# EAGLE design AVR_ISP_programmer (EAGLE 5.09)
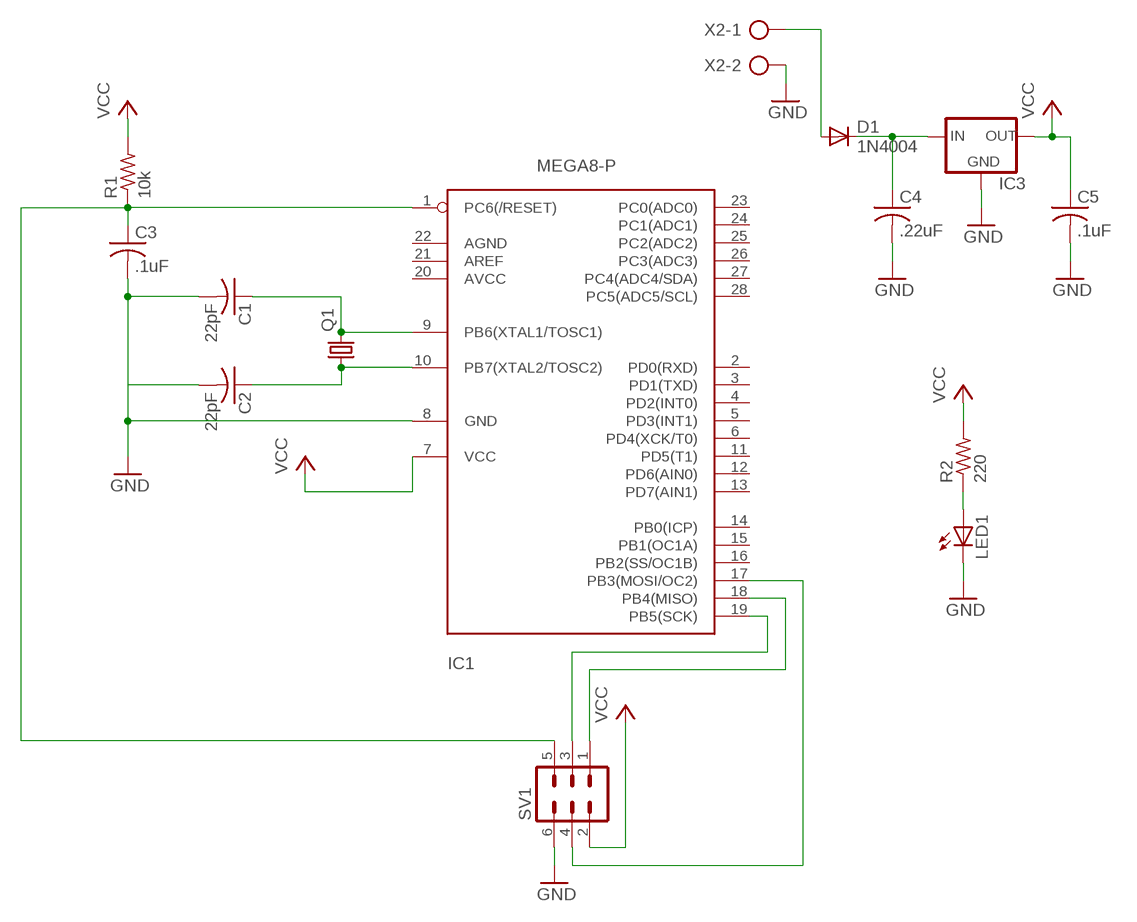
[diagram p0: schematic, sheet 1]

## Parts
C1  22pF  C-US025-024X044  [C025-024X044]
C2  22pF  C-US025-024X044  [C025-024X044]
C3  .1uF  C-US050-030X075  [C050-030X075]
C4  .22uF  C-US025-024X044  [C025-024X044]
C5  .1uF  C-US025-024X044  [C025-024X044]
D1  1N4004  [DO41-10]
IC1  MEGA8-P  [DIL28-3]
IC3  78XXS  [78XXS]
LED1  LED3MM  [LED3MM]
Q1  CRYSTALHC18U-V  [HC18U-V]
R1  10k  R-US_0207/10  [0207/10]
R2  220  R-US_0207/10  [0207/10]
SV1  MA03-2  [MA03-2]
X2  AK300/2  [AK300/2]

## Nets
GND: C1.2 C2.2 C3.2 C4.2 C5.2 IC1.8(GND) IC3.GND LED1.K(C) SV1.6 X2.2
N$1: LED1.A R2.1
N$2: C1.1 IC1.9(PB6(XTAL1/TOSC1)) Q1.2
N$3: C2.1 IC1.10(PB7(XTAL2/TOSC2)) Q1.1
N$4: C3.1 IC1.1(PC6(/RESET)) R1.1 SV1.5
N$5: C4.1 D1.C IC3.IN
N$6: D1.A X2.1
N$7: IC1.18(PB4(MISO)) SV1.1
N$8: IC1.19(PB5(SCK)) SV1.3
N$9: IC1.17(PB3(MOSI/OC2)) SV1.4
VCC: C5.1 IC1.7(VCC) IC3.OUT R1.2 R2.2 SV1.2
Unconnected: IC1.2(PD0(RXD)) IC1.3(PD1(TXD)) IC1.4(PD2(INT0)) IC1.5(PD3(INT1)) IC1.6(PD4(XCK/T0)) IC1.11(PD5(T1)) IC1.12(PD6(AIN0)) IC1.13(PD7(AIN1)) IC1.14(PB0(ICP)) IC1.15(PB1(OC1A)) IC1.16(PB2(SS/OC1B)) IC1.21(AREF) IC1.23(PC0(ADC0)) IC1.24(PC1(ADC1)) IC1.25(PC2(ADC2)) IC1.26(PC3(ADC3)) IC1.27(PC4(ADC4/SDA)) IC1.28(PC5(ADC5/SCL))

## Power pins joined to a net without a drawn wire
AGND: IC1.22(AGND)
AVCC: IC1.20(AVCC)

## Library data of the parts
C1-C5 = resistor:C-US: CAPACITOR, American symbol
D1 = diode:1N4004: DIODE general purpose rectifier, 1 A
IC1 = atmel:MEGA8-P: MICROCONTROLLER 8 Kbytes FLASH, 1 kbytes SRAM, 512 bytes EEPROM, USART, 4-channel 10 bit ADC, 2-channel 8 bit ADC Pin compatible with Atmega48, ATMega88, ATMega168 Source: avr.lbr
IC3 = v-reg:78XXS: VOLTAGE REGULATOR
LED1 = led:LED: LED OSRAM: - CHIPLED LG R971, LG N971, LY N971, LG Q971, LY Q971, LO R971, LY R971 LH N974, LH R974 LS Q976, LO Q976, LY Q976 LO Q996 - Hyper CHIPLED LW Q18S LB Q993, LB Q99A, LB R99A - SideLED LS A670, LO A670, LY A670, LG A670, LP A670 LB A673, LV A673, LT A673, LW A673 LH A674 LY A675 LS A676, LA A676, LO A676, LY A676, LW A676 LS A679, LY A679, LG A679 - Hyper Micro SIDELED® LS Y876, LA Y876, LO Y876, LY Y876 LT Y87S - SmartLED LW L88C, LW L88S LB L89C, LB L89S, LG L890 LS L89K, LO L89K, LY L89K LS L896, LA L896, LO L896, LY L896 - TOPLED LS T670, LO T670, LY T670, LG T670, LP T670 LSG T670, LSP T670, LSY T670, LOP T670, LYG T670 LG T671, LOG T671, LSG T671 LB T673, LV T673, LT T673, LW T673 LH T674 LS T676, LA T676, LO T676, LY T676, LB T676, LH T676, LSB T676, LW T676 LB T67C, LV T67C, LT T67C, LS T67K, LO T67K, LY T67K, LW E67C LS E67B, LA E67B, LO E67B, LY E67B, LB E67C, LV E67C, LT E67C LW T67C LS T679, LY T679, LG T679 LS T770, LO T770, LY T770, LG T770, LP T770 LB T773, LV T773, LT T773, LW T773 LH T774 LS E675, LA E675, LY E675, LS T675 LS T776, LA T776, LO T776, LY T776, LB T776 LHGB T686 LT T68C, LB T68C - Hyper Mini TOPLED® LB M676 - Mini TOPLED Santana® LG M470 LS M47K, LO M47K, LY M47K Source: http://www.osram.convergy.de LUXEON: - LUMILED® LXK2-PW12-R00, LXK2-PW12-S00, LXK2-PW14-U00, LXK2-PW14-V00 LXK2-PM12-R00, LXK2-PM12-S00, LXK2-PM14-U00 LXK2-PE12-Q00, LXK2-PE12-R00, LXK2-PE12-S00, LXK2-PE14-T00, LXK2-PE14-U00 LXK2-PB12-K00, LXK2-PB12-L00, LXK2-PB12-M00, LXK2-PB14-N00, LXK2-PB14-P00, LXK2-PB14-Q00 LXK2-PR12-L00, LXK2-PR12-M00, LXK2-PR14-Q00, LXK2-PR14-R00 LXK2-PD12-Q00, LXK2-PD12-R00, LXK2-PD12-S00 LXK2-PH12-R00, LXK2-PH12-S00 LXK2-PL12-P00, LXK2-PL12-Q00, LXK2-PL12-R00 Source: www.luxeon.com KINGBRIGHT: KA-3528ASYC Source: www.kingbright.com
Q1 = crystal:CRYSTAL: CRYSTAL
R1 R2 = resistor:R-US_: RESISTOR, American symbol
SV1 = con-lstb:MA03-2: PIN HEADER
X2 = con-ptr500:AK300/2: CONNECTOR

## Board
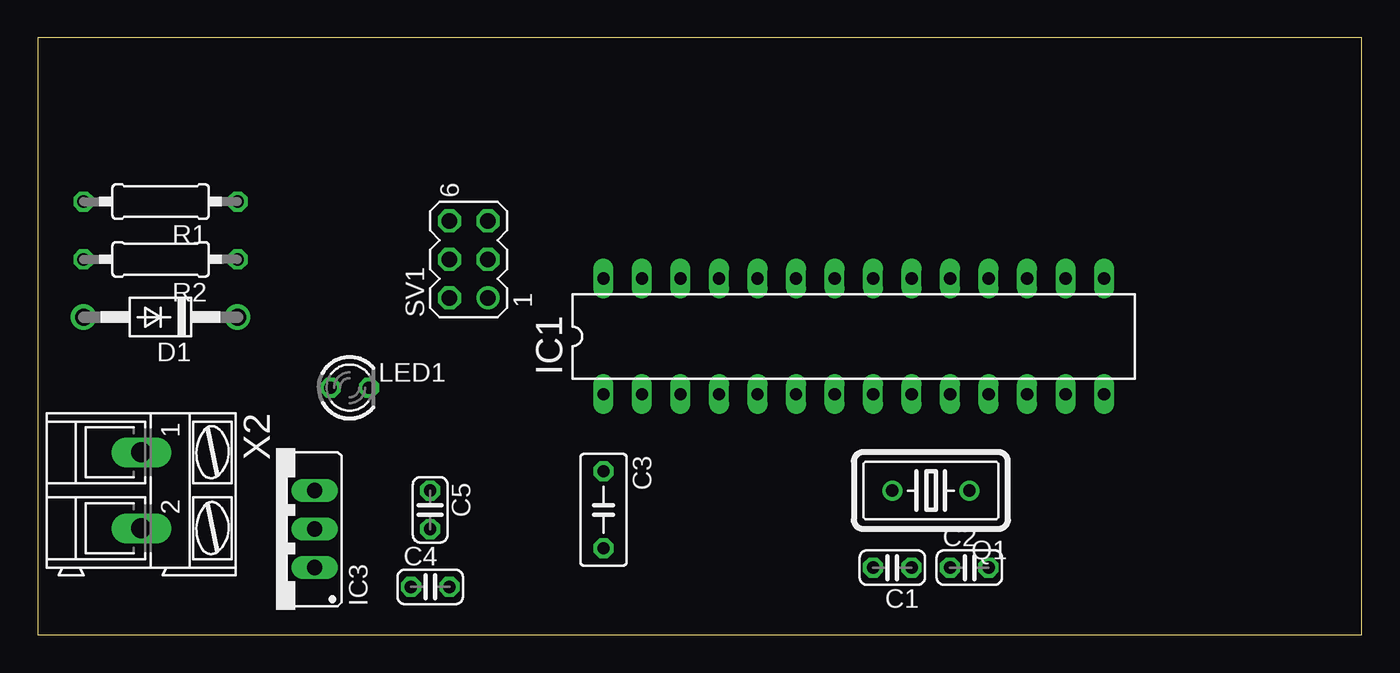
[diagram p1: board, top side]
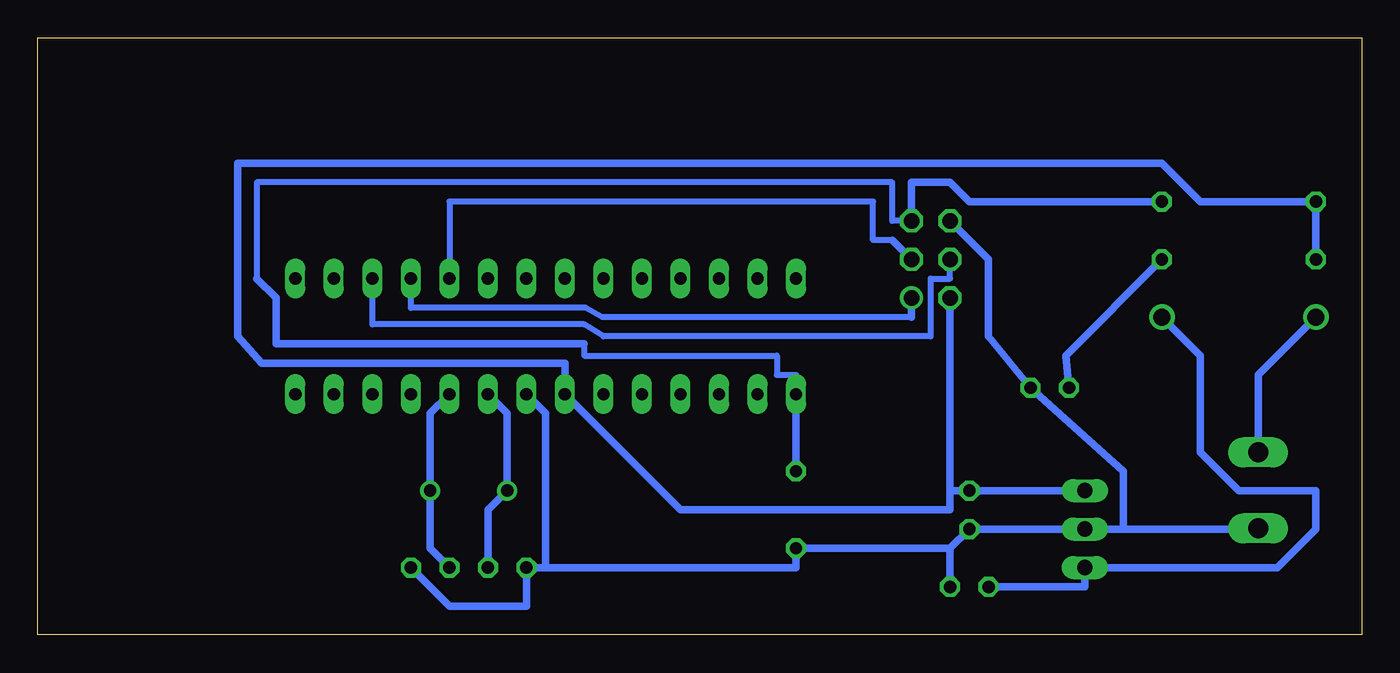
[diagram p2: board, bottom side, seen from below]

Size 87.3 x 39.36 mm. Coordinates in mm from the lower left corner, seen from the top.
Outline: 0,0 87.3,0 87.3,39.36 0,39.36 0,0
Copper layers (1*16): Top 0.035mm / dielectric 1.5mm / Bottom 0.035mm
Design rules "default *": minimum track width 20mil, minimum drill 24mil, track to track 16mil, track to pad 16mil, pad to pad 16mil, via to via 16mil, smd to smd 8mil, copper to edge 40mil, drill to drill 8mil, minimum pad ring 10mil, minimum via ring 8mil, stop-mask expansion 4mil, vias tented up to drill 0mil, thermal gap 10mil

### Footprints (pad centres in the part's own frame; a part is rotated, then mirrored left to right if it is on the bottom)
C025-024X044 = drill 0.813 octagon: 1 -1.27,0; 2 1.27,0
C050-030X075 = drill 0.813 octagon: 1 -2.54,0; 2 2.54,0
DO41-10 = drill 1.118 round: A 5.08,0; C -5.08,0
DIL28-3 = drill 0.813 long: 1 -16.51,-3.81; 2 -13.97,-3.81; 3 -11.43,-3.81; 4 -8.89,-3.81; 5 -6.35,-3.81; 6 -3.81,-3.81; 7 -1.27,-3.81; 8 1.27,-3.81; 9 3.81,-3.81; 10 6.35,-3.81; 11 8.89,-3.81; 12 11.43,-3.81; 13 13.97,-3.81; 14 16.51,-3.81; 15 16.51,3.81; 16 13.97,3.81; 17 11.43,3.81; 18 8.89,3.81; 19 6.35,3.81; 20 3.81,3.81; 21 1.27,3.81; 22 -1.27,3.81; 23 -3.81,3.81; 24 -6.35,3.81; 25 -8.89,3.81; 26 -11.43,3.81; 27 -13.97,3.81; 28 -16.51,3.81
78XXS = drill 1.016 long: GND 0,-2.54; IN -2.54,-2.54; OUT 2.54,-2.54
LED3MM = drill 0.813 octagon: A -1.27,0; K 1.27,0
HC18U-V = drill 0.813 round: 1 -2.54,0; 2 2.54,0
0207/10 = drill 0.813 octagon: 1 -5.08,0; 2 5.08,0
MA03-2 = drill 1.016 round: 1 -2.54,-1.27 | drill 1.016 octagon: 2 -2.54,1.27; 3 0,-1.27; 4 0,1.27; 5 2.54,-1.27; 6 2.54,1.27
AK300/2 = drill 1.321 long: 1 -2.515,0; 2 2.489,0

### Placement (x,y rotation side)
C1  56.35,4.44 180 top
C2  61.43,4.44 0 top
C3  37.3,8.25 270 top
C4  25.87,3.17 0 top
C5  25.87,8.25 270 top
D1  8.09,20.95 180 top
IC1  53.81,19.68 0 top
IC3  15.71,6.98 90 top
LED1  20.56,16.3 0 top
Q1  58.89,9.52 180 top
R1  8.09,28.57 180 top
R2  8.09,24.76 180 top
SV1  28.41,24.76 90 top
X2  6.82,9.52 270 top

### Tracks (layer width: path | path; a pad name or v marks a point on that pad's centre or on a via)
GND
  Bottom 0.508: SV1.6 24.6,24.76 24.6,19.68 LED1.K 15.71,10.79 15.71,6.98 | 27.14,5.71 C5.2 IC3.GND 15.71,6.98 | 27.14,5.71 C4.2 | 27.14,5.71 C3.2 37.3,4.44 53.81,4.44 | 53.81,4.44 C1.2 55.08,1.9 60.16,1.9 C2.2 | IC1.8 53.81,14.6 53.81,4.44 | 15.71,6.98 6.82,6.98 X2.2
N$1
  Bottom 0.508: R2.1 19.52,18.41 LED1.A
N$2
  Bottom 0.508: C1.1 57.62,8.25 Q1.2 56.35,14.6 IC1.9
N$3
  Bottom 0.508: C2.1 61.43,5.71 Q1.1 61.43,14.6 IC1.10
N$4
  Bottom 0.406: SV1.5 30.95,27.3 30.95,29.84 72.86,29.84 72.86,23.49 | IC1.1 37.3,17.14 38.57,17.14 38.57,18.41 51.27,18.41 51.27,19.2
  Bottom 0.508: IC1.1 C3.1 | R1.1 25.87,28.57 27.14,29.84 29.68,29.84 SV1.5 | 51.27,19.2 71.59,19.2 71.59,22.22 72.86,23.49
N$5
  Bottom 0.508: C4.1 18.25,3.17 IC3.IN 5.55,4.44 3.01,6.98 3.01,9.52 8.09,9.52 10.63,12.06 10.63,18.41 D1.C
N$6
  Bottom 0.508: D1.A 6.82,17.14 X2.1
N$7
  Bottom 0.406: 29.68,20.95 50.08,20.95 51.19,21.58 62.7,21.56 IC1.18
  Bottom 0.508: SV1.1 29.68,20.95
N$8
  Bottom 0.406: 30.95,26.03 32.22,26.03 32.22,28.57 60.16,28.57 IC1.19
  Bottom 0.508: SV1.3 30.95,26.03
N$9
  Bottom 0.406: SV1.4 27.14,23.49 28.41,23.49 28.41,19.68 50,19.68 51.27,20.47 65.24,20.47 IC1.17
VCC
  Bottom 0.508: IC3.OUT C5.1 27.14,9.52 | R2.2 R1.2 10.63,28.57 13.17,31.11 74.13,31.11 74.13,19.68 72.53,17.93 52.54,17.9 IC1.7 44.92,8.25 27.14,8.25 27.14,9.52 | 27.14,9.52 SV1.2